# EAGLE schematic GDEnvSensorNode_1_5 (EAGLE 9.0.1)

## Sheet 1 of 2
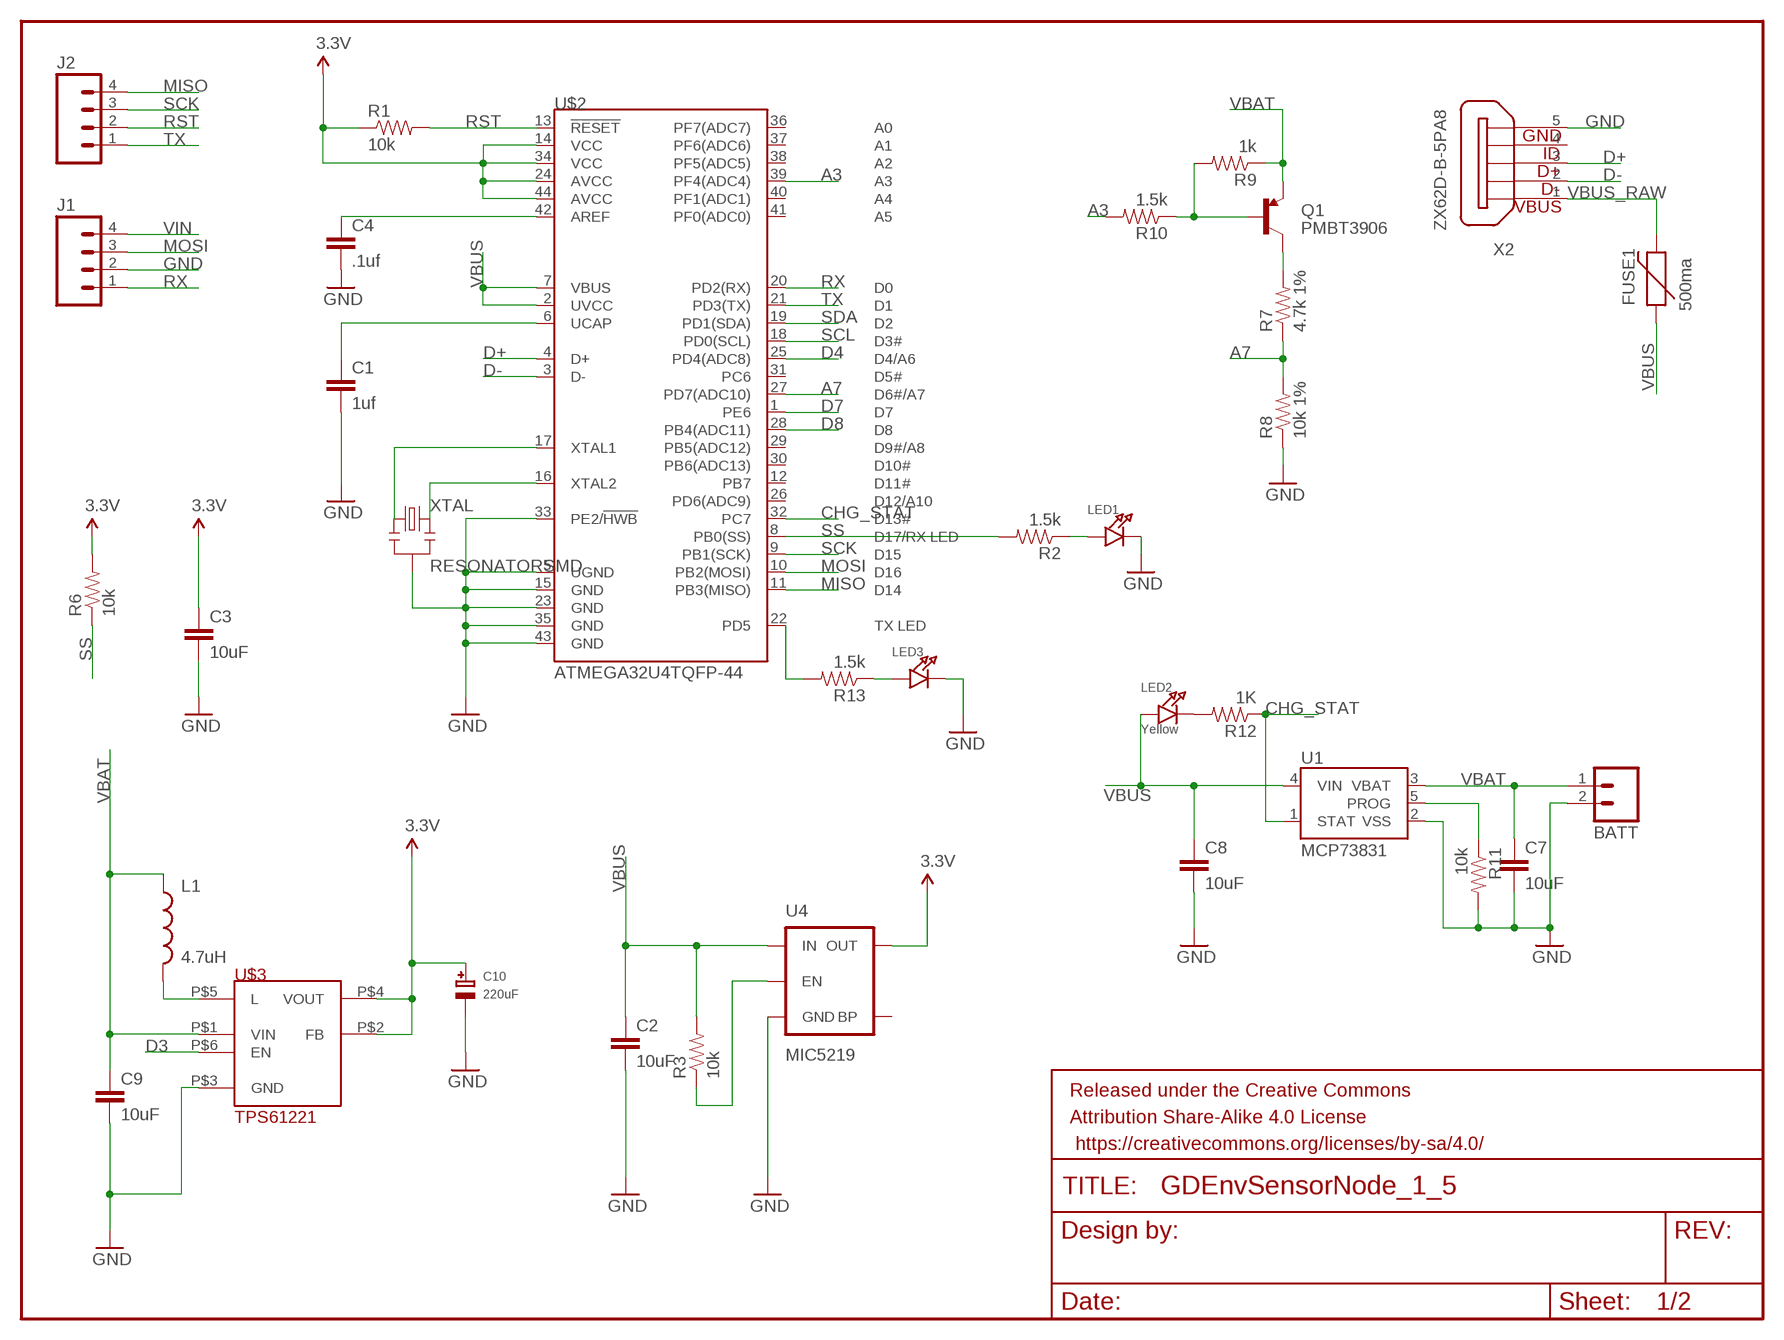
[diagram p0: schematic, sheet 1]

### Parts
BATT  M02JST-PTH-2  [JST-2-PTH]
C1  1uf  CAP0805  [0805]
C2  10uF  CAP0805  [0805]
C3  10uF  CAP0805  [0805]
C4  .1uf  CAP0805  [0805]
C7  10uF  CAP0805  [0805]
C8  10uF  CAP0805  [0805]
C9  10uF  CAP0805  [0805]
C10  220uF  CAP_TANTALUMB/3528_REFLOW  [EIA3528-21/B-R]
FRAME1  FRAME-LETTER  [CREATIVE_COMMONS]
FUSE1  500ma  PTCSMD  [PTC-1206]
J1  M04PTH  [1X04]
J2  M04PTH  [1X04]
L1  4.7uH  INDUCTOR1210  [1210]
LED1  LED0805  [CHIPLED_0805]
LED2  Yellow  LED0805  [CHIPLED_0805]
LED3  LED0805  [CHIPLED_0805]
Q1  PMBT3906  TRANSISTOR_PNPPMBT3906  [SOT23-3]
R1  10k  RESISTOR0805-RES  [0805]
R2  1.5k  RESISTOR0805-RES  [0805]
R3  10k  RESISTOR0805-RES  [0805]
R6  10k  RESISTOR0805-RES  [0805]
R7  4.7k 1%  RESISTOR0805-RES  [0805]
R8  10k 1%  RESISTOR0805-RES  [0805]
R9  1k  RESISTOR0805-RES  [0805]
R10  1.5k  RESISTOR0805-RES  [0805]
R11  10k  RESISTOR0805-RES  [0805]
R12  1K  RESISTOR0805-RES  [0805]
R13  1.5k  RESISTOR0805-RES  [0805]
U1  MCP73831  [SOT23-5]
U4  MIC5219  V_REG_MIC52193.3V  [SOT23-5]
U$2  ATMEGA32U4TQFP-44  [TQFP44]
U$3  TPS61221  [TPS61221]
X2  ZX62D-B-5PA8  [ZX62D-B-5PA8]
XTAL  RESONATORSMD  [RESONATOR-SMD]

### Nets
3.3V: C3.1 C10.+ R1.1 R6.2 U4.5(OUT) U$2.14(VCC) U$2.24(AVCC) U$2.34(VCC) U$2.44(AVCC) U$3.P$2(FB) U$3.P$4(VOUT) ; also sheet 2
A3: R10.2 U$2.39(PF4(ADC4))
A7: R7.1 R8.2 U$2.27(PD7(ADC10))
CHG_STAT: R12.1 U1.1(STAT) U$2.32(PC7)
D3: U$3.P$6(EN)
D4: U$2.25(PD4(ADC8)) ; also sheet 2
D7: U$2.1(PE6) ; also sheet 2
D8: U$2.28(PB4(ADC11)) ; also sheet 2
D+: U$2.4(D+) X2.3
D-: U$2.3(D-) X2.2
GND: BATT.2 C1.2 C2.2 C3.2 C4.2 C7.2 C8.2 C9.2 C10.- J1.2 LED1.C LED3.C R8.1 R11.2 U1.2(VSS) U4.2(GND) U$2.5(UGND) U$2.15(GND) U$2.23(GND) U$2.33(PE2/!HWB) U$2.35(GND) U$2.43(GND) U$3.P$3(GND) X2.5 XTAL.2 ; also sheet 2
L: L1.2 U$3.P$5(L)
MISO: J2.4 U$2.11(PB3(MISO)) ; also sheet 2
MOSI: J1.3 U$2.10(PB2(MOSI)) ; also sheet 2
N$1: U$2.16(XTAL2) XTAL.3
N$2: U$2.17(XTAL1) XTAL.1
N$3: LED1.A R2.1
N$4: LED2.C R12.2
N$7: C4.1 U$2.42(AREF)
N$8: LED3.A R13.1
N$10: R3.1 U4.3(EN)
N$11: Q1.1(B) R9.2 R10.1
N$12: Q1.3(C) R7.2
N$13: R13.2 U$2.22(PD5)
N$16: R11.1 U1.5(PROG)
N$20: C1.1 U$2.6(UCAP)
RST: J2.2 R1.2 U$2.13(!RESET)
RX: J1.1 U$2.20(PD2(RX))
SCK: J2.3 U$2.9(PB1(SCK)) ; also sheet 2
SCL: U$2.18(PD0(SCL)) ; also sheet 2
SDA: U$2.19(PD1(SDA)) ; also sheet 2
SS: R2.2 R6.1 U$2.8(PB0(SS))
TX: J2.1 U$2.21(PD3(TX))
VBAT: BATT.1 C7.1 C9.1 L1.1 Q1.2(E) R9.1 U1.3(VBAT) U$3.P$1(VIN)
VBUS: C2.1 C8.1 FUSE1.1 LED2.A R3.2 U1.4(VIN) U4.1(IN) U$2.2(UVCC) U$2.7(VBUS)
VBUS_RAW: FUSE1.2 X2.1
VIN: J1.4
Unconnected: U4.4(BP) U$2.12(PB7) U$2.26(PD6(ADC9)) U$2.29(PB5(ADC12)) U$2.30(PB6(ADC13)) U$2.31(PC6) U$2.36(PF7(ADC7)) U$2.37(PF6(ADC6)) U$2.38(PF5(ADC5)) U$2.40(PF1(ADC1)) U$2.41(PF0(ADC0)) X2.4 X2.S1 X2.S2 X2.S3 X2.S4

## Sheet 2 of 2
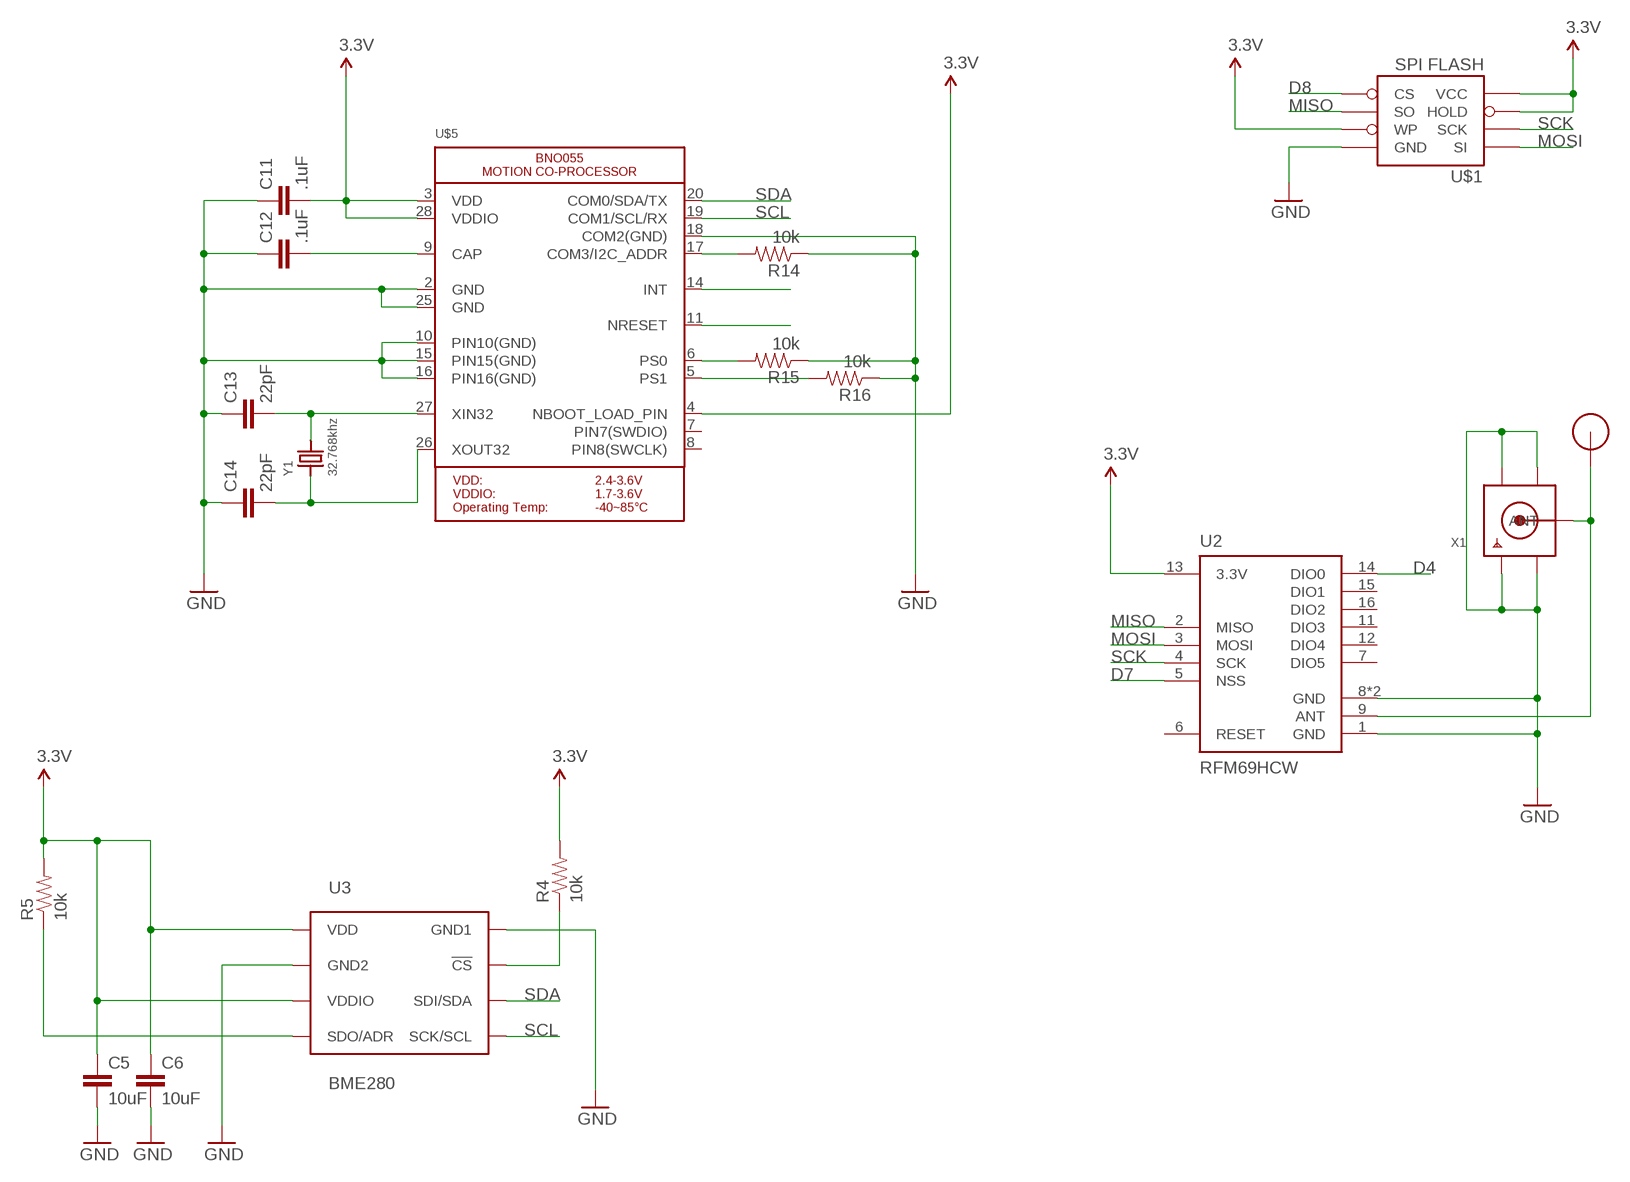
[diagram p1: schematic, sheet 2]

### Parts
C5  10uF  CAP0805  [0805]
C6  10uF  CAP0805  [0805]
C11  .1uF  CAP0805  [0805]
C12  .1uF  CAP0805  [0805]
C13  22pF  CAP0805  [0805]
C14  22pF  CAP0805  [0805]
R4  10k  RESISTOR0805-RES  [0805]
R5  10k  RESISTOR0805-RES  [0805]
R14  10k  RESISTOR0805-RES  [0805]
R15  10k  RESISTOR0805-RES  [0805]
R16  10k  RESISTOR0805-RES  [0805]
U2  RFM69HCW  [RFM69HCW-XXXS2]
U3  BME280  [BME280_LGA]
U$1  SPI FLASH  AT25F512BJEDEC_3.9MM  [SO08]
U$4  RFM12B_ANTENNA  [RFM12B-ANTENNA]
U$5  MICROBUILDER_BNO055  [MICROBUILDER_BNO055]
X1  SMACONNECTOR_EDGE_UFL  [SMA_EDGELAUNCH_UFL]
Y1  32.768khz  CRYSTAL8X3.8SMT  [CRYSTAL_8X3.8]

### Nets
3.3V: C11.2 R4.2 U2.13(3.3V) U$1.3_WP(WP) U$1.7_HOLD(HOLD) U$1.8_VCC(VCC) U$5.3(VDD) U$5.4(NBOOT_LOAD_PIN) U$5.28(VDDIO) ; also sheet 1
ANT: U2.9(ANT) U$4.P$1 X1.P(ANT)
D4: U2.14(DIO0) ; also sheet 1
D7: U2.5(NSS) ; also sheet 1
D8: U$1.1_CS(CS) ; also sheet 1
GND: C5.2 C6.2 C11.1 C12.1 C13.1 C14.1 R14.1 R15.1 R16.1 U2.1(GND) U2.8(GND) U2.10(GND) U3.P$1(GND1) U3.P$7(GND2) U$1.4_GND(GND) U$5.2(GND) U$5.10(PIN10(GND)) U$5.15(PIN15(GND)) U$5.16(PIN16(GND)) U$5.18(COM2(GND)) U$5.25(GND) X1.GND@1(GND1) X1.GND@2(GND2) X1.GND@3(GND3) X1.GND@4(GND4) ; also sheet 1
MISO: U2.2(MISO) U$1.2_SO(SO) ; also sheet 1
MOSI: U2.3(MOSI) U$1.5_SI(SI) ; also sheet 1
N$5: R4.1 U3.P$2(!CS)
N$9: C12.2 U$5.9(CAP)
N$15: C5.1 C6.1 R5.2 U3.P$6(VDDIO) U3.P$8(VDD)
N$17: R5.1 U3.P$5(SDO/ADR)
N$19: C13.2 U$5.27(XIN32) Y1.P$4
N$21: C14.2 U$5.26(XOUT32) Y1.P$1
N$25: U$5.14(INT)
N$26: U$5.11(NRESET)
N$27: R14.2 U$5.17(COM3/I2C_ADDR)
N$28: R15.2 U$5.6(PS0)
N$29: R16.2 U$5.5(PS1)
SCK: U2.4(SCK) U$1.6_SCK(SCK) ; also sheet 1
SCL: U3.P$4(SCK/SCL) U$5.19(COM1/SCL/RX) ; also sheet 1
SDA: U3.P$3(SDI/SDA) U$5.20(COM0/SDA/TX) ; also sheet 1
Unconnected: U2.6(RESET) U2.7(DIO5) U2.11(DIO3) U2.12(DIO4) U2.15(DIO1) U2.16(DIO2) U$5.7(PIN7(SWDIO)) U$5.8(PIN8(SWCLK))

## Library data of the parts
BATT = SparkFun-Connectors-ME_Desktop:M02: Standard 2-pin 0.1" header. Use with - straight break away headers ( PRT-00116) - right angle break away headers (PRT-00553) - swiss pins (PRT-00743) - machine pins (PRT-00117) - female headers (PRT-00115) Molex polarized connector foot print use with: PRT-08233 with associated crimp pins and housings. 2.54_SCREWTERM for use with PRT-10571. 3.5mm Screw Terminal footprints for PRT-08084 5mm Screw Terminal footprints for use with PRT-08432; PROD_ID: CONN-09863; SKU: PRT-09914
C1-C9 C11-C14 = SparkFun-Capacitors:CAP: Capacitor Standard 0603 ceramic capacitor, and 0.1" leaded capacitor.
C10 = microbuilder:CAP_TANTALUM: Tantalum Capacitors Wave footprints have larger pads and are meant to be used for hand soldering. Reflow footprints are optimised for solder paste and a reflow oven. EIA3216-18/A-[R/W] - Size A / 3216-18 / 1206 footprint 4.7µF 25V 10% Tantalum Capacitor 10µF 16V 10% Tantalum Capacitor [Digikey: 495-2236-2-ND] EIA3528-21/B-[R/W] - Size B / 3528-21 47µF 10V 10% Tantalum Capactior [Digikey: 495-2216-1-ND] EIA6032-28/C-[R/W] - Size C / 6032-28 10µF 35V 20% Tantalum Capacitor [Digikey: 495-2285-1-ND] 100µF 16V 10% Tantalum Capactior [Digikey: 399-5214-1-ND]
FRAME1 = SparkFun-Aesthetics:FRAME-LETTER: Schematic Frame Standard 8.5x11 US Letter frame
FUSE1 = SparkFun-PowerIC:PTC: Resettable Fuse PTC Resettable Fuse. Spark Fun Electronics SKU : COM-08357; PROD_ID: RES-11150
J1 J2 = SparkFun-Connectors:M04: Header 4 Standard 4-pin 0.1" header. Use with straight break away headers (SKU : PRT-00116), right angle break away headers (PRT-00553), swiss pins (PRT-00743), machine pins (PRT-00117), and female headers (PRT-00115). Molex polarized connector foot print use with SKU : PRT-08231 with associated crimp pins and housings. 1MM SMD Version SKU: PRT-10208; PROD_ID: CONN-09696
L1 = SparkFun-Passives:INDUCTOR: Inductors Basic Inductor/Choke - 0603 and 1206. Footprints are not proven and vary greatly between part numbers. INDUCTOR POWER 3.3UH 4.0A SMD 0.197" L x 0.197" W x 0.177" H (5.00mm x 5.00mm x 4.50mm)
LED1-LED3 = microbuilder:LED: LED 0603 - 0603 Surface Mount Package 2mA: Green LED - Low Power (3.9mcd, 2ma, 1.7Vf) - Digikey: 475-2709-2-ND Orange LED - Low Power (9.8mcd, 2ma, 1.8Vf) - Digikey: 475-1194-2-ND Red LED - Low Power (5mcd, 2ma, 1.8Vf) - Digikey: 475-1195-2-ND Yellow LED - Low Power (7mcd, 2ma, 1.8Vf) - Digikey: 475-1196-2-ND 5mA: Blue LED - Low Power (17mcd, 5ma, 2.9Vf) - Digikey: LNJ937W8CRACT-ND 0805 - 0805 Surface Mount Package 2mA: Red LED (8.8mcd, 2mA, 1.8Vf, Clear) - Low Power [Digikey: 475-2510-1-ND] Green LED (5mcd, 2mA, 1.8Vf, Clear) - Low Power [Digikey: 475-2730-1-ND] Yellow LED (11.3mcd, 2mA, 1.8Vf, Clear) - Low Power [Digikey: 475-2555-1-ND] 20mA: Red LED (104mcd, 20mA, Diffused) - LS R976 [Digikey: 475-1278-6-ND] Red LED (12mcd, 20mA, 2.0Vf, Clear) - APT2012EC [Digikey: 754-1128-1-ND] Green LED (15mcd, 20mA, 2.2Vf, Clear) - APT2012GC [Digikey: 754-1131-1-ND] Orange LED (160mcd, 20mA, 2.1Vf, Clear) - APT2012SECK [Digikey: 754-1130-1-ND] 1206 - 1206 Surface Mount Package Green LED (26mcd, 20mA, Diffused) - LG N971 [Digikey: 475-1407-6-ND] Red LED (15mcd, 20mA, Diffused) - LH N974 [Digikey: 475-1416-6-ND]
Q1 = SparkFun-DiscreteSemi:TRANSISTOR_PNP: Generic PNP BJT Double check pinouts against datasheets- not all devices are the same! MMBT3906 - 40V 200mA SOT-23 (TRANS-08052) MMBT4403 - 40V 600mA SOT-23 (TRANS-09245); PROD_ID: TRANS-08052
R1-R16 = SparkFun-Passives:RESISTOR: Resistor Basic schematic elements and footprints for 0603, 1206, and PTH resistors.
U1 = SparkFun-PowerIC:MCP73831: Miniature single cell, fully integrated Li-Ion, Li-polymer charge management controller http://ww1.microchip.com/downloads/en/DeviceDoc/20001984g.pdf IC-09995; PROD_ID: IC-09995
U2 = SparkFun-RF:RFM69H; PROD_ID: IC-11997, IC-12053
U3 = BME280ComponentLibrary:BME280; PROD_ID: IC-13090
U4 = SparkFun-PowerIC:V_REG_MIC5219: V_REG MIC5219 Standard 3.3V and 5V 500mA LDO voltage regulator in SOT-23 layout. Micrel part MIC5219. BP (by-pass) pin is used to lower output noise with 470pF cap, may be left open.; PROD_ID: VREG-09872; VALUE: MIC5219 3.3V
U$1 = LowPowerLab:AT25F512B: 4-Mbit SPI flash memory
U$2 = SparkFun-DigitalIC:ATMEGA32U4: Atmel 44-pin 8-bit Microcontroller with 32KBytes of ISP Flash and USB Controller
U$3 = GDTech:TPS61221; AVAILABILITY: Unavailable; DESCRIPTION: the tps6122x family devices provide a power-supply solution for products powered by either a single-cell two-cell or ...; MF: Texas Instruments; MP: TPS61221; PACKAGE: SC-70 Texas Instruments; PRICE: None
U$4 = LowPowerLab:RFM12B_ANTENNA
U$5 = Adafruit BNO055:MICROBUILDER_BNO055: BNO055 - Motion Co-Processor
X1 = adafruit:SMACONNECTOR: SMA Connector 90° DIP SMA Connector, 50 Ohm (4UConnector: 07259)
X2 = GDTech:ZX62D-B-5PA8: Micro USB Type B Connector - Standard, Shell Through Hole Source: http://www.hirose.co.jp/cataloge_hp/ed_ZX_20140804.pdf; MF: Hirose; MPN: ZX62D-B-5PA8; OC_FARNELL: 2300438; OC_NEWARK: 69W0712
XTAL = GDTech:RESONATOR: Resonator Small SMD resonator. This is the itty bitty 10/20MHz resonators with built in caps. CSTCE10M0G55 and CSTCE20M0V53. Footprint has been reviewed closely but hasn't been tested yet.
Y1 = microbuilder:CRYSTAL: Crystals HC49UP - Surface Mount Crystal 4.0MHz 18pF +/-30ppm Surface Mount Crystal [Digikey: 535-9857-1-ND] 12.0 MHz Surface Mount Crystal [Digikey: 535-9869-6-ND] 25.0 MHz Surface Mount Crystal [Digikey: 535-9078-1-ND] 2.5 x 2.0mm - MEMs SMT Crystal 16.0 MHz 10pF 20ppm 2.5 x 2.0mm Crystal [Digikey -40-85°C: 535-10923-1-ND] 3.2 x 2.5mm - MEMs SMT Crystal 12.0 MHz 8pF 15ppm 3.2 x 2.5mm Crystal [Digikey: -10-70°C: 644-1047-1-ND -40-125°C: 644-1128-1-ND] 16.0 MHz 8pF 15ppm 3.2 x 2.5mm Crystal [Digikey: -10-70°C: 644-1049-1-ND -40-125°C: 644-1129-2-ND] 16.0 MHz 10pF 10ppm 3.2 x 2.5mm Crystal [Digikey: 644-1100-1-ND] 27.12 MHz 18pF 30ppm 3.2 x 2.5mm Crystal [Digikey: 887-1424-1-ND] 27.12MHz 10pF 10ppm 3.2 x 2.5mm Crystal [Digikey: 887-1329-1-ND] 4.9 x 1.8mm - MEMs SMT Crystal 32.768 KHz 12.5pF 20ppm 4.9 x 1.8mm Crystal [Digikey: SE2415CT-ND] 8.0 x 3.8mm - Surface Mount Crystal 32.768kHz 12.5pF 20ppm -40°C-85°C [Digikey: 535-9166-2-ND] Cylinder 32.768KHz Cylinder Crystal (2x6mm body) [Ex. Digikey: 300-8341-2-ND]